# EAGLE design AVerCADE_Dip_SF (EAGLE 7.2.0)
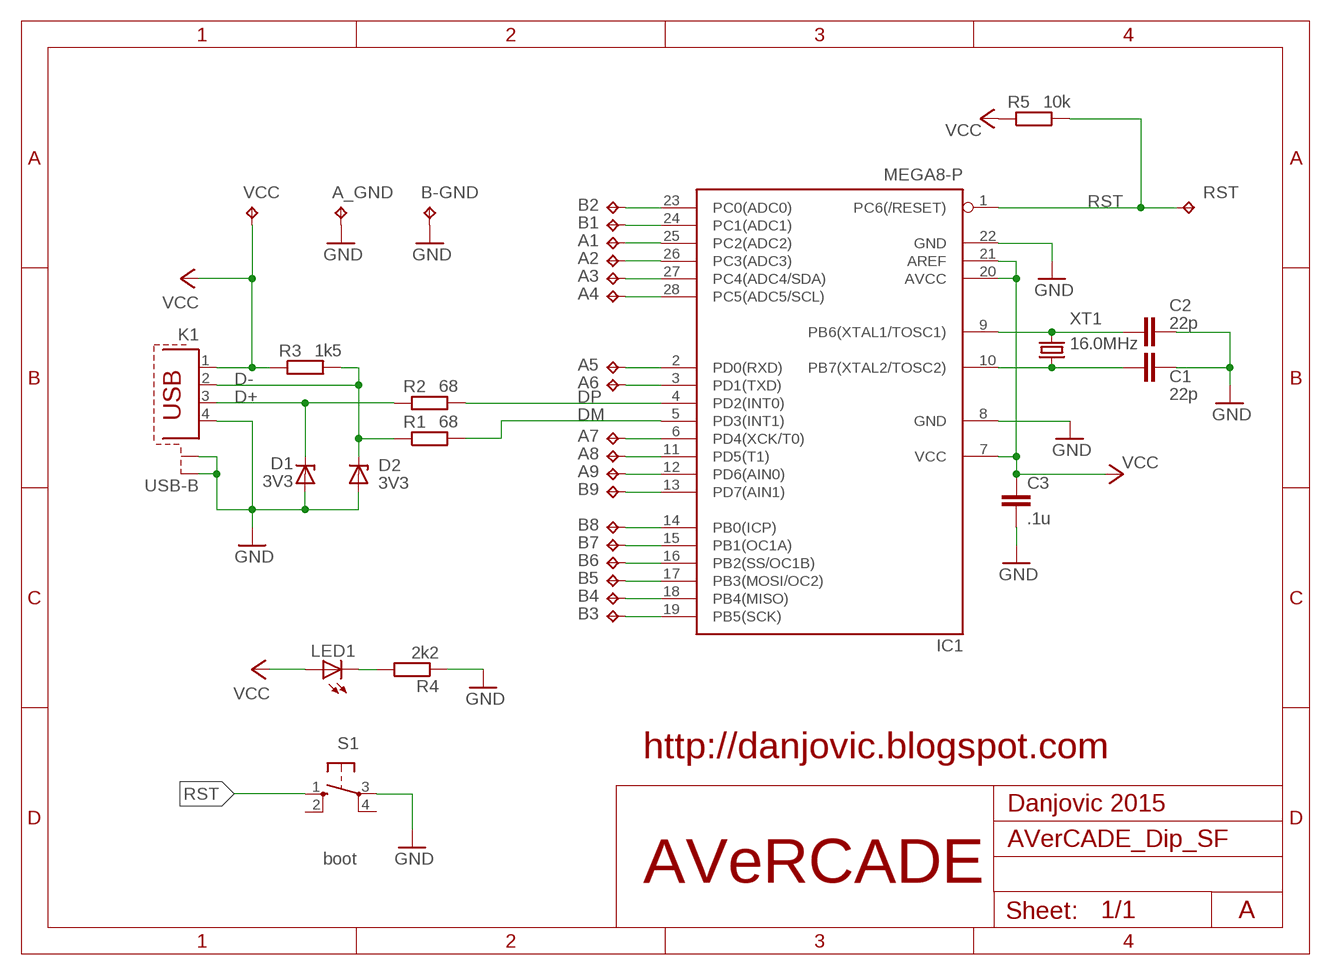
[diagram p0: schematic, sheet 1]

## Parts
A1  TPPAD1-13  [P1-13]
A2  TPPAD1-13  [P1-13]
A3  TPPAD1-13  [P1-13]
A4  TPPAD1-13  [P1-13]
A5  TPPAD1-13  [P1-13]
A6  TPPAD1-13  [P1-13]
A7  TPPAD1-13  [P1-13]
A8  TPPAD1-13  [P1-13]
A9  TPPAD1-13  [P1-13]
A_GND  TPPAD1-13  [P1-13]
B1  TPPAD1-13  [P1-13]
B2  TPPAD1-13  [P1-13]
B3  TPPAD1-13  [P1-13]
B4  TPPAD1-13  [P1-13]
B5  TPPAD1-13  [P1-13]
B6  TPPAD1-13  [P1-13]
B7  TPPAD1-13  [P1-13]
B8  TPPAD1-13  [P1-13]
B9  TPPAD1-13  [P1-13]
B-GND  TPPAD1-13  [P1-13]
C1  22p  C-EUC025-24X044L  [C025-24X044L]
C2  22p  C-EUC025-24X044L  [C025-24X044L]
C3  .1u  C-EUC050-025X075L  [C050-025X075L]
D1  3V3  ZENER-DIODEZDIO-5L  [ZDIO-5L]
D2  3V3  ZENER-DIODEZDIO-5L  [ZDIO-5L]
IC1  MEGA8-P  [DIL28-3]
K1  USB-B  PN61729-SPN61729-SL  [PN61729-SL]
LED1  LEDLED3MML  [LED3MML]
R1  68  R-EU_0207/7L  [0207/7L]
R2  68  R-EU_0207/7L  [0207/7L]
R3  1k5  R-EU_0207/7L  [0207/7L]
R4  2k2  R-EU_0207/7L  [0207/7L]
R5  10k  R-EU_0207/7L  [0207/7L]
RST  TPPAD1-13  [P1-13]
S1  10-XX  [B3F-10XX]
VCC  TPPAD1-13  [P1-13]
XT1  16.0MHz  CRYSTALHC49U-V  [HC49U-V]

## Nets
AN2: A1.TP IC1.25(PC2(ADC2))
AN3: A2.TP IC1.26(PC3(ADC3))
D+: D1.C K1.3 R2.3
D-: D2.C K1.2 R1.3 R3.4
DM: IC1.5(PD3(INT1)) R1.4
DP: IC1.4(PD2(INT0)) R2.4
GND: A_GND.TP B-GND.TP C1.2 C2.2 C3.2 D1.A D2.A IC1.8(GND) IC1.22(GND) K1.4 K1.S1 K1.S2 R4.3 S1.3(P)
N$1: A5.TP IC1.2(PD0(RXD))
N$2: A7.TP IC1.6(PD4(XCK/T0))
N$3: B1.TP IC1.24(PC1(ADC1))
N$4: B2.TP IC1.23(PC0(ADC0))
N$5: A3.TP IC1.27(PC4(ADC4/SDA))
N$6: A4.TP IC1.28(PC5(ADC5/SCL))
N$7: A6.TP IC1.3(PD1(TXD))
N$8: A8.TP IC1.11(PD5(T1))
N$9: A9.TP IC1.12(PD6(AIN0))
N$10: B9.TP IC1.13(PD7(AIN1))
N$11: LED1.K(C) R4.4
N$12: B8.TP IC1.14(PB0(ICP))
N$13: B6.TP IC1.16(PB2(SS/OC1B))
N$14: B7.TP IC1.15(PB1(OC1A))
N$15: B3.TP IC1.19(PB5(SCK))
N$16: B4.TP IC1.18(PB4(MISO))
N$17: B5.TP IC1.17(PB3(MOSI/OC2))
RST: IC1.1(PC6(/RESET)) R5.4 RST.TP S1.1(S)
VCC: C3.1 IC1.7(VCC) IC1.20(AVCC) IC1.21(AREF) K1.1 LED1.A R3.3 R5.3 VCC.TP
X1: C2.1 IC1.9(PB6(XTAL1/TOSC1)) XT1.2
X2: C1.1 IC1.10(PB7(XTAL2/TOSC2)) XT1.1
Unconnected: S1.2(S1) S1.4(P1)

## Notes on the sheet
- http://danjovic.blogspot.com
- Danjovic 2015
- boot
- AVeRCADE
- A

## Library data of the parts
A1-A9 A_GND B1-B9 B-GND RST VCC = testpad:TP: Test pad
C1-C3 = rcl:C-EU: CAPACITOR, European symbol
D1 D2 = diode:ZENER-DIODE: Z-Diode
IC1 = atmel:MEGA8-P: MICROCONTROLLER 8 Kbytes FLASH, 1 kbytes SRAM, 512 bytes EEPROM, USART, 4-channel 10 bit ADC, 2-channel 8 bit ADC Pin compatible with Atmega48, ATMega88, ATMega168 Source: avr.lbr; OC_FARNELL: unknown; OC_NEWARK: unknown
K1 = con-berg:PN61729-S: BERG USB connector
LED1 = led:LED: LED OSRAM: - CHIPLED LG R971, LG N971, LY N971, LG Q971, LY Q971, LO R971, LY R971 LH N974, LH R974 LS Q976, LO Q976, LY Q976 LO Q996 - Hyper CHIPLED LW Q18S LB Q993, LB Q99A, LB R99A - SideLED LS A670, LO A670, LY A670, LG A670, LP A670 LB A673, LV A673, LT A673, LW A673 LH A674 LY A675 LS A676, LA A676, LO A676, LY A676, LW A676 LS A679, LY A679, LG A679 - Hyper Micro SIDELED® LS Y876, LA Y876, LO Y876, LY Y876 LT Y87S - SmartLED LW L88C, LW L88S LB L89C, LB L89S, LG L890 LS L89K, LO L89K, LY L89K LS L896, LA L896, LO L896, LY L896 - TOPLED LS T670, LO T670, LY T670, LG T670, LP T670 LSG T670, LSP T670, LSY T670, LOP T670, LYG T670 LG T671, LOG T671, LSG T671 LB T673, LV T673, LT T673, LW T673 LH T674 LS T676, LA T676, LO T676, LY T676, LB T676, LH T676, LSB T676, LW T676 LB T67C, LV T67C, LT T67C, LS T67K, LO T67K, LY T67K, LW E67C LS E67B, LA E67B, LO E67B, LY E67B, LB E67C, LV E67C, LT E67C LW T67C LS T679, LY T679, LG T679 LS T770, LO T770, LY T770, LG T770, LP T770 LB T773, LV T773, LT T773, LW T773 LH T774 LS E675, LA E675, LY E675, LS T675 LS T776, LA T776, LO T776, LY T776, LB T776 LHGB T686 LT T68C, LB T68C - Hyper Mini TOPLED® LB M676 - Mini TOPLED Santana® LG M470 LS M47K, LO M47K, LY M47K Source: http://www.osram.convergy.de LUXEON: - LUMILED® LXK2-PW12-R00, LXK2-PW12-S00, LXK2-PW14-U00, LXK2-PW14-V00 LXK2-PM12-R00, LXK2-PM12-S00, LXK2-PM14-U00 LXK2-PE12-Q00, LXK2-PE12-R00, LXK2-PE12-S00, LXK2-PE14-T00, LXK2-PE14-U00 LXK2-PB12-K00, LXK2-PB12-L00, LXK2-PB12-M00, LXK2-PB14-N00, LXK2-PB14-P00, LXK2-PB14-Q00 LXK2-PR12-L00, LXK2-PR12-M00, LXK2-PR14-Q00, LXK2-PR14-R00 LXK2-PD12-Q00, LXK2-PD12-R00, LXK2-PD12-S00 LXK2-PH12-R00, LXK2-PH12-S00 LXK2-PL12-P00, LXK2-PL12-Q00, LXK2-PL12-R00 Source: www.luxeon.com KINGBRIGHT: KA-3528ASYC Source: www.kingbright.com
R1-R5 = rcl:R-EU_: RESISTOR, European symbol
S1 = switch-omron:10-XX: OMRON SWITCH; MPN: B3F-1000; OC_FARNELL: 176432; OC_NEWARK: 36M3542
XT1 = crystal:CRYSTAL: CRYSTAL; OC_FARNELL: 1666969; OC_NEWARK: unknown

## Board
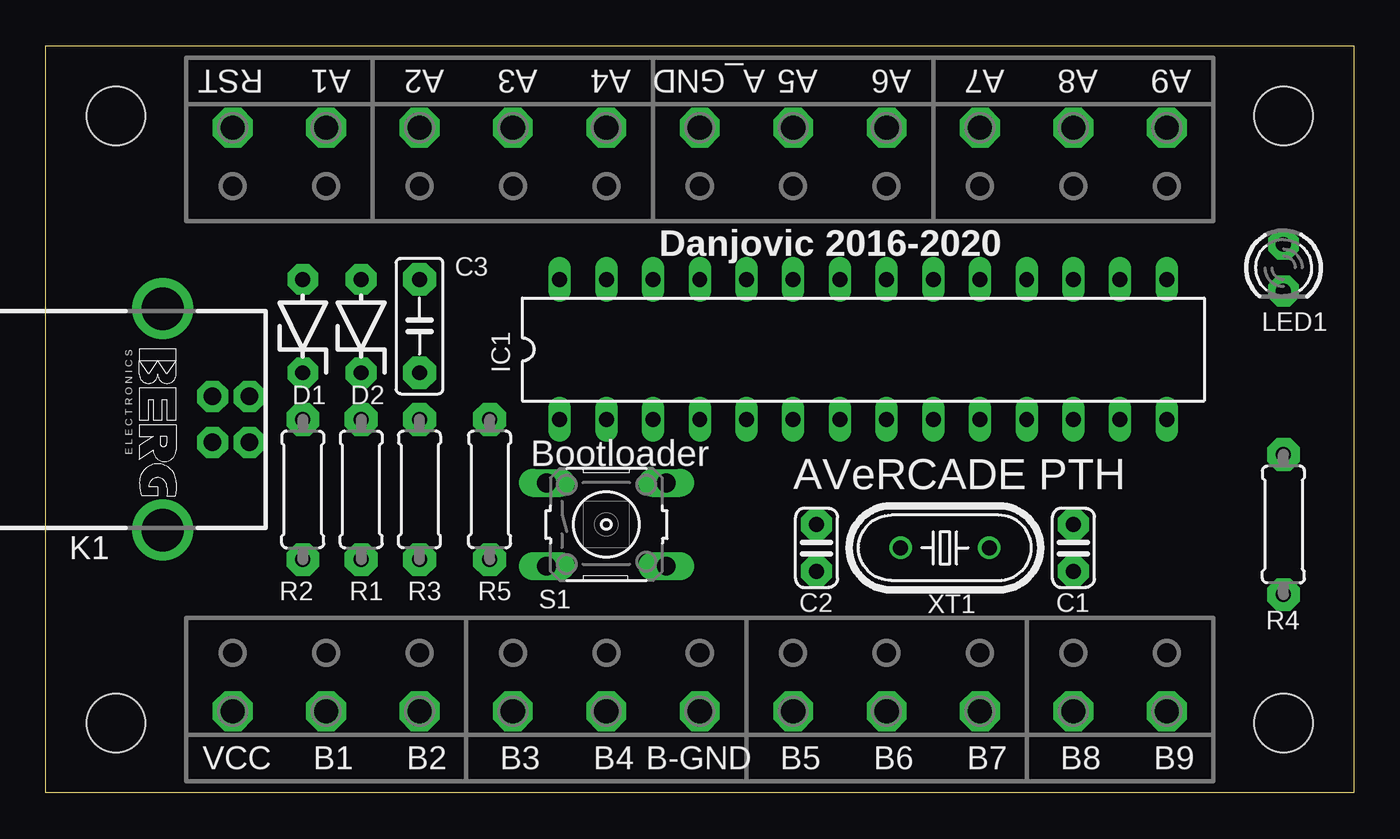
[diagram p1: board, top side]
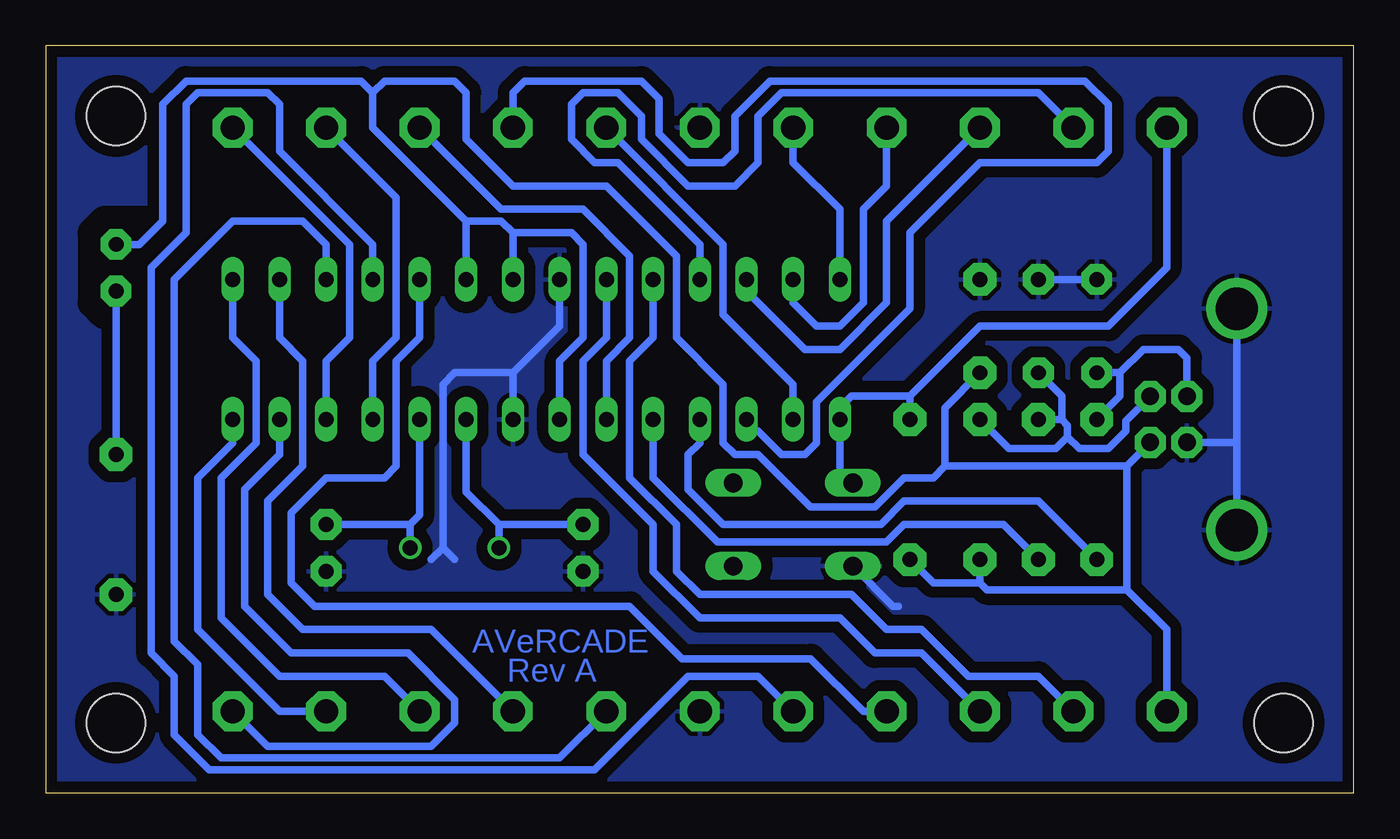
[diagram p2: board, bottom side, seen from below]

Size 71.12 x 40.64 mm. Coordinates in mm from the lower left corner, seen from the top.
Outline: 0,40.64 71.12,40.64 71.12,0 0,0 0,40.64
Copper layers (1*16): Top 0.0356mm / dielectric 1.5011mm / Bottom 0.0356mm
Design rules "LaenPCBOrder *": minimum track width 6mil, minimum drill 13mil, track to track 6mil, track to pad 6mil, pad to pad 6mil, via to via 6mil, smd to smd 6mil, copper to edge 15mil, drill to drill 6mil, minimum pad ring 7mil, minimum via ring 7mil, stop-mask expansion 3mil, vias tented up to drill 0mil, thermal gap 10mil
Holes 3.2 mm at 3.81,36.83 67.31,36.83 67.31,3.81 3.81,3.81
bRestrict: 4 lines

### Footprints (pad centres in the part's own frame; a part is rotated, then mirrored left to right if it is on the bottom)
P1-13 = drill 1.321 pad 2.159 octagon: TP 0,0
C025-24X044L = drill 0.813 pad 1.676 octagon: 1 -1.27,0; 2 1.27,0
C050-025X075L = drill 0.813 pad 1.778 octagon: 1 -2.54,0; 2 2.54,0
ZDIO-5L = drill 0.813 pad 1.676 octagon: A 2.54,0; C -2.54,0
DIL28-3 = drill 0.813 long: 1 -16.51,-3.81; 2 -13.97,-3.81; 3 -11.43,-3.81; 4 -8.89,-3.81; 5 -6.35,-3.81; 6 -3.81,-3.81; 7 -1.27,-3.81; 8 1.27,-3.81; 9 3.81,-3.81; 10 6.35,-3.81; 11 8.89,-3.81; 12 11.43,-3.81; 13 13.97,-3.81; 14 16.51,-3.81; 15 16.51,3.81; 16 13.97,3.81; 17 11.43,3.81; 18 8.89,3.81; 19 6.35,3.81; 20 3.81,3.81; 21 1.27,3.81; 22 -1.27,3.81; 23 -3.81,3.81; 24 -6.35,3.81; 25 -8.89,3.81; 26 -11.43,3.81; 27 -13.97,3.81; 28 -16.51,3.81
PN61729-SL = drill 0.95 pad 1.676 octagon: 1 1.25,4.71; 2 -1.25,4.71; 3 -1.25,2.71; 4 1.25,2.71 | drill 2.3 pad 2.9: S1 -6.02,0; S2 6.02,0
LED3MML = drill 0.813 pad 1.676 octagon: A -1.27,0; K 1.27,0
0207/7L = drill 0.813 pad 1.778 octagon: 3 -3.81,0; 4 3.81,0
B3F-10XX = drill 1.016 long: 1 -3.251,2.261; 2 3.251,2.261; 3 -3.251,-2.261; 4 3.251,-2.261
HC49U-V = drill 0.813: 1 -2.413,0; 2 2.413,0

### Placement (x,y rotation side)
A1  15.24,36.2 270 top
A2  20.32,36.2 270 top
A3  25.4,36.2 270 top
A4  30.48,36.2 270 top
A5  40.64,36.2 0 top
A6  45.72,36.2 0 top
A7  50.8,36.2 0 top
A8  55.88,36.2 0 top
A9  60.96,36.2 0 top
A_GND  35.56,36.2 0 top
B1  15.24,4.45 0 top
B2  20.32,4.45 0 top
B3  25.4,4.45 0 top
B4  30.48,4.45 0 top
B5  40.64,4.45 180 top
B6  45.72,4.45 180 top
B7  50.8,4.45 180 top
B8  55.88,4.45 180 top
B9  60.96,4.45 180 top
B-GND  35.56,4.45 180 top
C1  55.88,13.34 270 top
C2  41.91,13.34 270 top
C3  20.32,25.4 90 top
D1  13.97,25.4 90 top
D2  17.14,25.4 90 top
IC1  44.45,24.13 0 top
K1  6.35,20.32 270 top
LED1  67.31,28.57 270 top
R1  17.14,16.51 270 top
R2  13.97,16.51 270 top
R3  20.32,16.51 90 top
R4  67.31,14.61 90 top
R5  24.13,16.51 90 top
RST  10.16,36.2 0 top
S1  30.48,14.61 0 top
VCC  10.16,4.45 0 top
XT1  48.9,13.34 180 top

### Tracks (layer width: path | path; a pad name or v marks a point on that pad's centre or on a via)
AN2
  Bottom 0.406: IC1.25 35.56,29.84 40.01,34.29 41.27,34.29 42.55,35.56 42.55,37.47 41.91,38.1 40.01,38.1 38.73,36.83 38.73,35.56 36.2,33.02 33.66,33.02 32.38,34.29 32.38,36.83 31.11,38.1 17.14,38.1 A1.TP
AN3
  Bottom 0.406: IC1.26 33.02,27.3 29.84,24.13 27.94,24.13 25.4,26.67 25.4,31.11 A2.TP
D+
  Bottom 0.406: K1.3 9.06,23.66 9.53,24.13 11.43,24.13 12.7,22.86 | 12.7,22.86 12.7,21.59 R2.3 | D1.C 12.7,22.86
D-
  Bottom 0.406: K1.2 12.38,20.25 12.38,19.68 13.34,18.73 14.92,18.73 15.56,19.37 | 15.56,19.37 15.56,20 15.88,20.32 | 15.88,20.32 15.88,21.59 D2.C | R1.3 15.88,20.32 | R3.4 18.73,18.73 16.19,18.73 15.56,19.37
DM
  Bottom 0.406: IC1.5 38.1,17.14 34.61,13.65 25.4,13.65 24.45,14.61 19.05,14.61 R1.4
DP
  Bottom 0.406: IC1.4 35.56,19.05 36.2,18.41 36.2,16.51 34.29,14.61 25.72,14.61 24.45,15.88 17.14,15.88 R2.4
GND
  Bottom 0.406: 49.53,13.34 49.53,22.23 48.9,22.86 45.72,22.86 | K1.S1 6.35,19.05 | 6.35,19.05 K1.S2 | K1.4 6.37,19.07 6.35,19.05 | D1.A D2.A | 48.9,12.7 49.53,13.34 | 49.53,13.34 50.16,12.7 | 45.72,22.86 IC1.8 | IC1.22 43.18,25.4 45.72,22.86 | S1.3 25.04,10.16 24.77,10.16
  pour Bottom (isolate 0.61): 0,0 0,40.64 71.12,40.64 71.12,0
N$1
  Bottom 0.406: A5.TP 34.29,29.84 34.29,26.04 30.48,22.23 IC1.2
N$2
  Bottom 0.406: IC1.6 40.64,23.5 39.37,24.77 39.37,29.21 41.91,31.75 46.35,31.75 A7.TP
N$3
  Bottom 0.406: IC1.24 38.1,24.77 39.37,23.5 39.37,17.14 36.83,14.61 36.83,12.06 35.56,10.79 27.3,10.79 25.4,8.89 23.5,8.89 20.95,6.35 17.14,6.35 B1.TP
N$4
  Bottom 0.406: B2.TP 23.5,7.62 26.04,7.62 27.94,9.53 35.56,9.53 38.1,12.06 38.1,14.61 41.91,18.41 41.91,23.5 40.64,24.77 IC1.23
N$5
  Bottom 0.406: IC1.27 30.48,26.67 29.21,25.4 27.94,25.4 26.67,26.67 26.67,31.75 25.4,33.02 A3.TP
N$6
  Bottom 0.406: IC1.28 27.94,31.75 30.48,34.29 A4.TP
N$7
  Bottom 0.406: A6.TP 45.72,38.1 45.09,38.73 38.73,38.73 37.78,37.78 37.78,35.88 36.2,34.29 34.29,34.29 33.66,34.92 33.66,36.83 31.75,38.73 14.61,38.73 13.34,37.47 13.34,34.92 13.97,34.29 20.32,34.29 24.13,30.48 24.13,26.35 29.21,21.27 29.21,19.05 29.84,18.41 31.11,18.41 32.38,19.68 33.02,19.68 IC1.3
N$8
  Bottom 0.406: IC1.11 53.34,23.5 52.07,24.77 52.07,32.38 A8.TP
N$9
  Bottom 0.406: IC1.12 55.88,23.5 54.61,24.77 54.61,29.84 A9.TP
N$10
  Bottom 0.406: IC1.13 58.42,18.41 60.33,16.51 60.33,10.16 57.78,7.62 51.44,7.62 48.9,5.08 48.9,3.81 50.16,2.54 59.05,2.54 B9.TP
N$11
  Bottom 0.406: LED1.K R4.4
N$12
  Bottom 0.406: IC1.14 60.96,19.05 62.87,17.14 62.87,8.89 58.42,4.45 B8.TP
N$13
  Bottom 0.406: IC1.16 58.42,24.77 57.15,23.5 57.15,17.78 59.05,15.88 59.05,10.79 57.15,8.89 50.16,8.89 B6.TP
N$14
  Bottom 0.406: IC1.15 60.96,24.77 59.69,23.5 59.69,19.05 61.59,17.14 61.59,9.53 58.42,6.35 52.7,6.35 B7.TP
N$15
  Bottom 0.406: IC1.19 50.8,24.77 52.07,23.5 52.07,17.78 52.7,17.14 55.88,17.14 57.78,15.24 57.78,11.43 56.52,10.16 39.37,10.16 36.51,7.3 29.53,7.3 26.67,4.45 B3.TP
N$16
  Bottom 0.406: B4.TP 32.38,6.35 36.2,6.35 41.27,1.27 62.23,1.27 64.14,3.17 64.14,6.35 65.41,7.62 65.41,28.57 63.5,30.48 63.5,37.47 62.87,38.1 59.05,38.1 58.42,37.47 58.42,34.92 53.34,29.84 IC1.18
N$17
  Bottom 0.406: IC1.17 55.88,29.84 57.15,31.11 60.96,31.11 64.14,27.94 64.14,8.26 62.87,6.99 62.87,3.17 61.59,1.91 43.18,1.91 B5.TP
RST
  Bottom 0.406: RST.TP 10.16,28.57 13.34,25.4 20.32,25.4 24.13,21.59 | 24.13,21.59 27.3,21.59 27.94,20.95 IC1.1 27.94,17.58 S1.1 | R5.4 24.13,21.59
VCC
  Bottom 0.406: VCC.TP 10.16,8.89 12.33,11.06 | 12.33,11.06 19.95,11.06 20.32,11.43 | LED1.A 66.04,29.84 64.77,31.11 64.77,37.47 63.5,38.73 53.98,38.73 53.34,38.1 | 53.34,38.1 53.34,36.2 48.26,31.11 | 48.26,31.11 IC1.20 | 45.72,30.48 46.35,31.11 48.26,31.11 | IC1.7 43.18,23.5 41.91,24.77 41.91,29.84 42.55,30.48 45.72,30.48 | 45.72,30.48 IC1.21 | 12.33,11.06 12.33,17.8 | 12.33,17.8 K1.1 | 22.23,17.78 12.35,17.78 12.33,17.8 | 53.34,38.1 52.7,38.73 48.9,38.73 48.26,38.1 48.26,35.56 45.72,33.02 40.64,33.02 36.83,29.21 36.83,24.77 34.29,22.23 34.29,19.05 33.66,18.41 32.38,18.41 29.53,15.56 26.04,15.56 24.45,17.14 22.86,17.14 22.23,17.78 | C3.1 22.23,20.95 22.23,17.78 | 20.32,11.43 22.86,11.43 R5.3 | R3.3 20.32,11.43
X1
  Bottom 0.406: 46.48,14.61 XT1.2 | IC1.9 48.26,16.38 46.48,14.61 | C2.1 46.48,14.61
X2
  Bottom 0.406: C1.1 51.31,14.61 | 51.31,14.61 XT1.1 | IC1.10 50.8,15.11 51.31,14.61

### Text on the board
Bottom: AVeRCADE | Rev A
tPlace: Danjovic 2016-2020 | Bootloader | AVeRCADE PTH